# EAGLE design MapleIoT_P2_V1.0 (EAGLE 9.6.2)

## Sheet 1 of 2
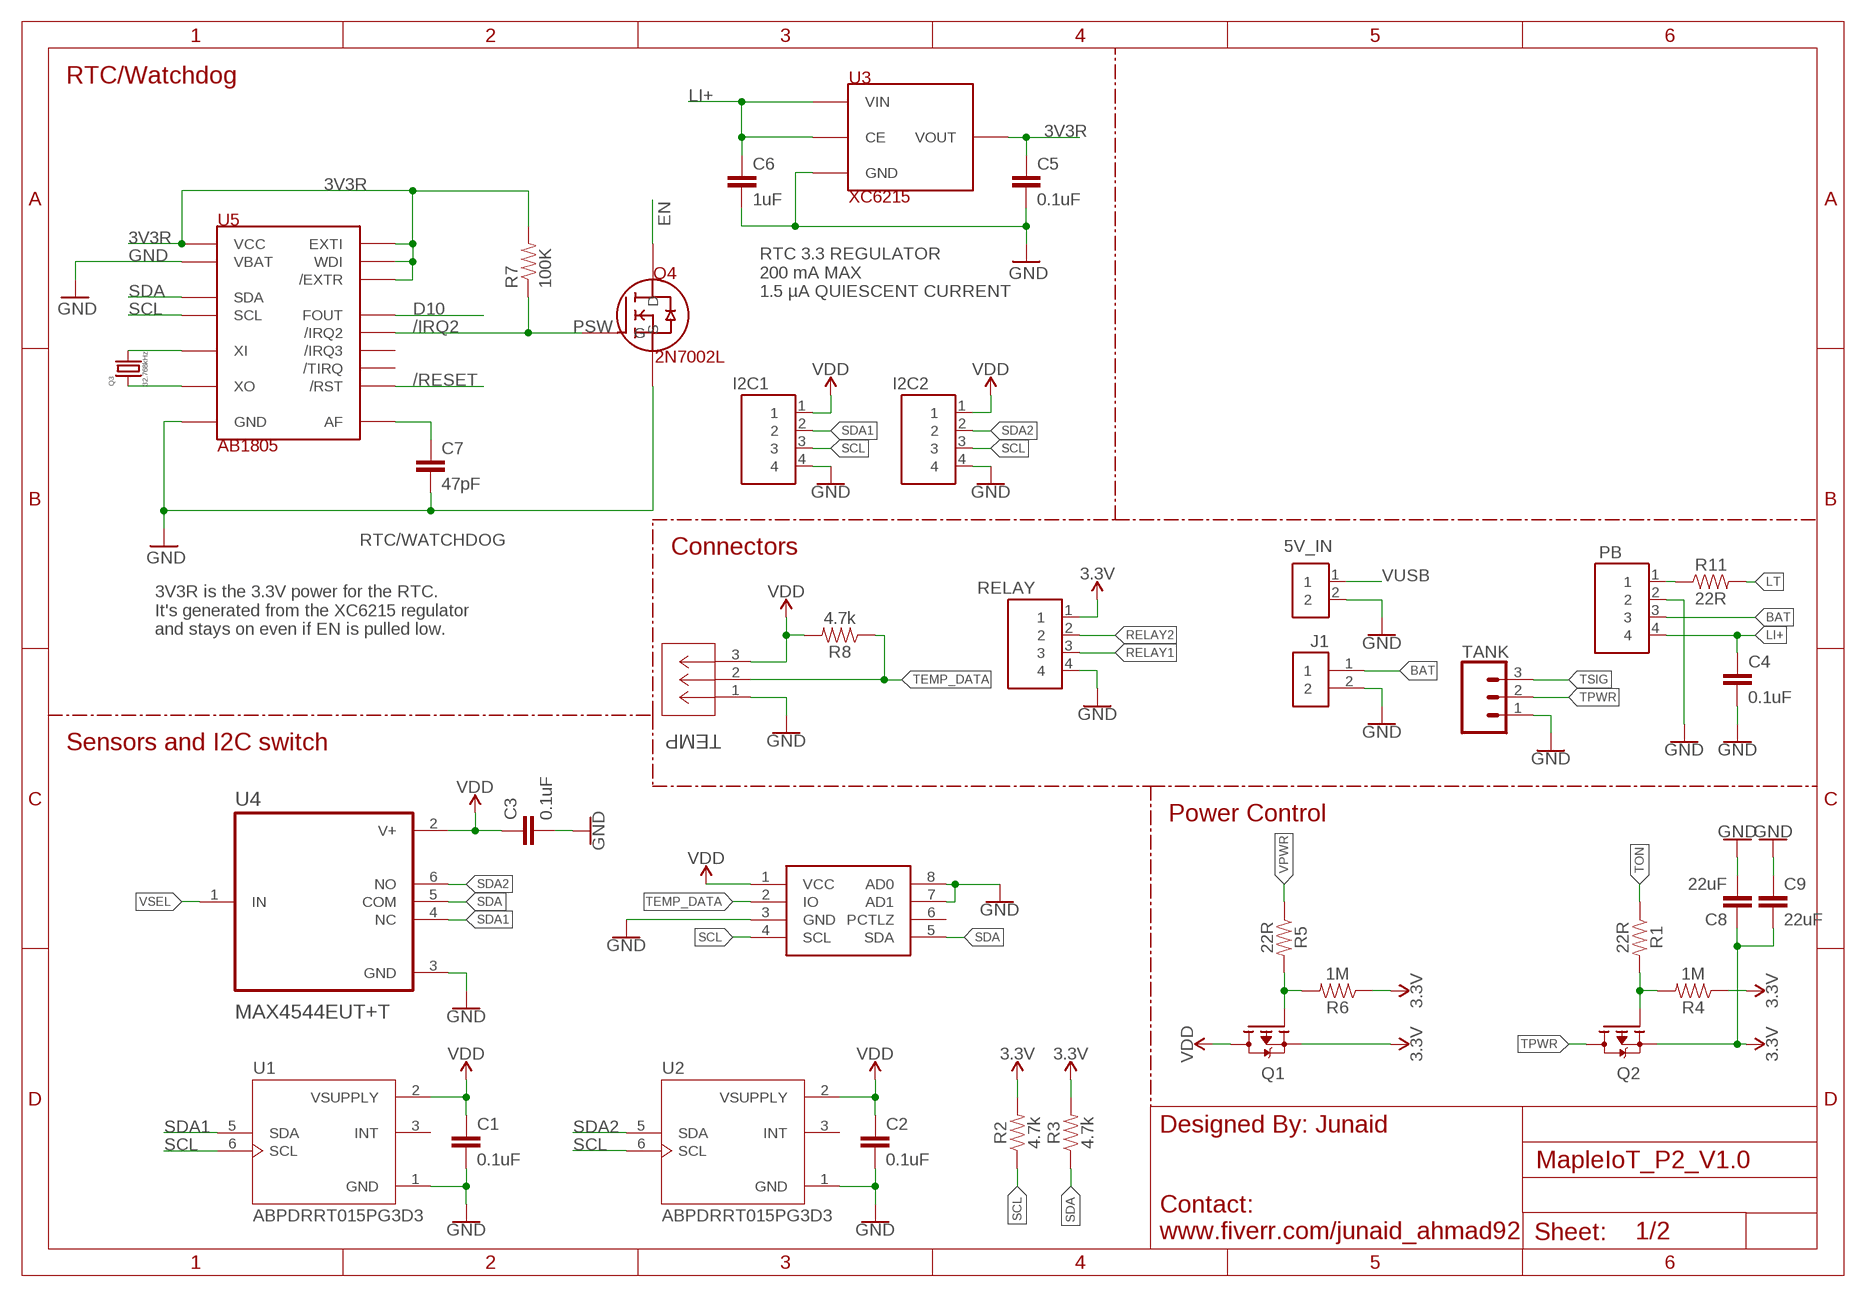
[diagram p0: schematic, sheet 1, part 1 of 2]
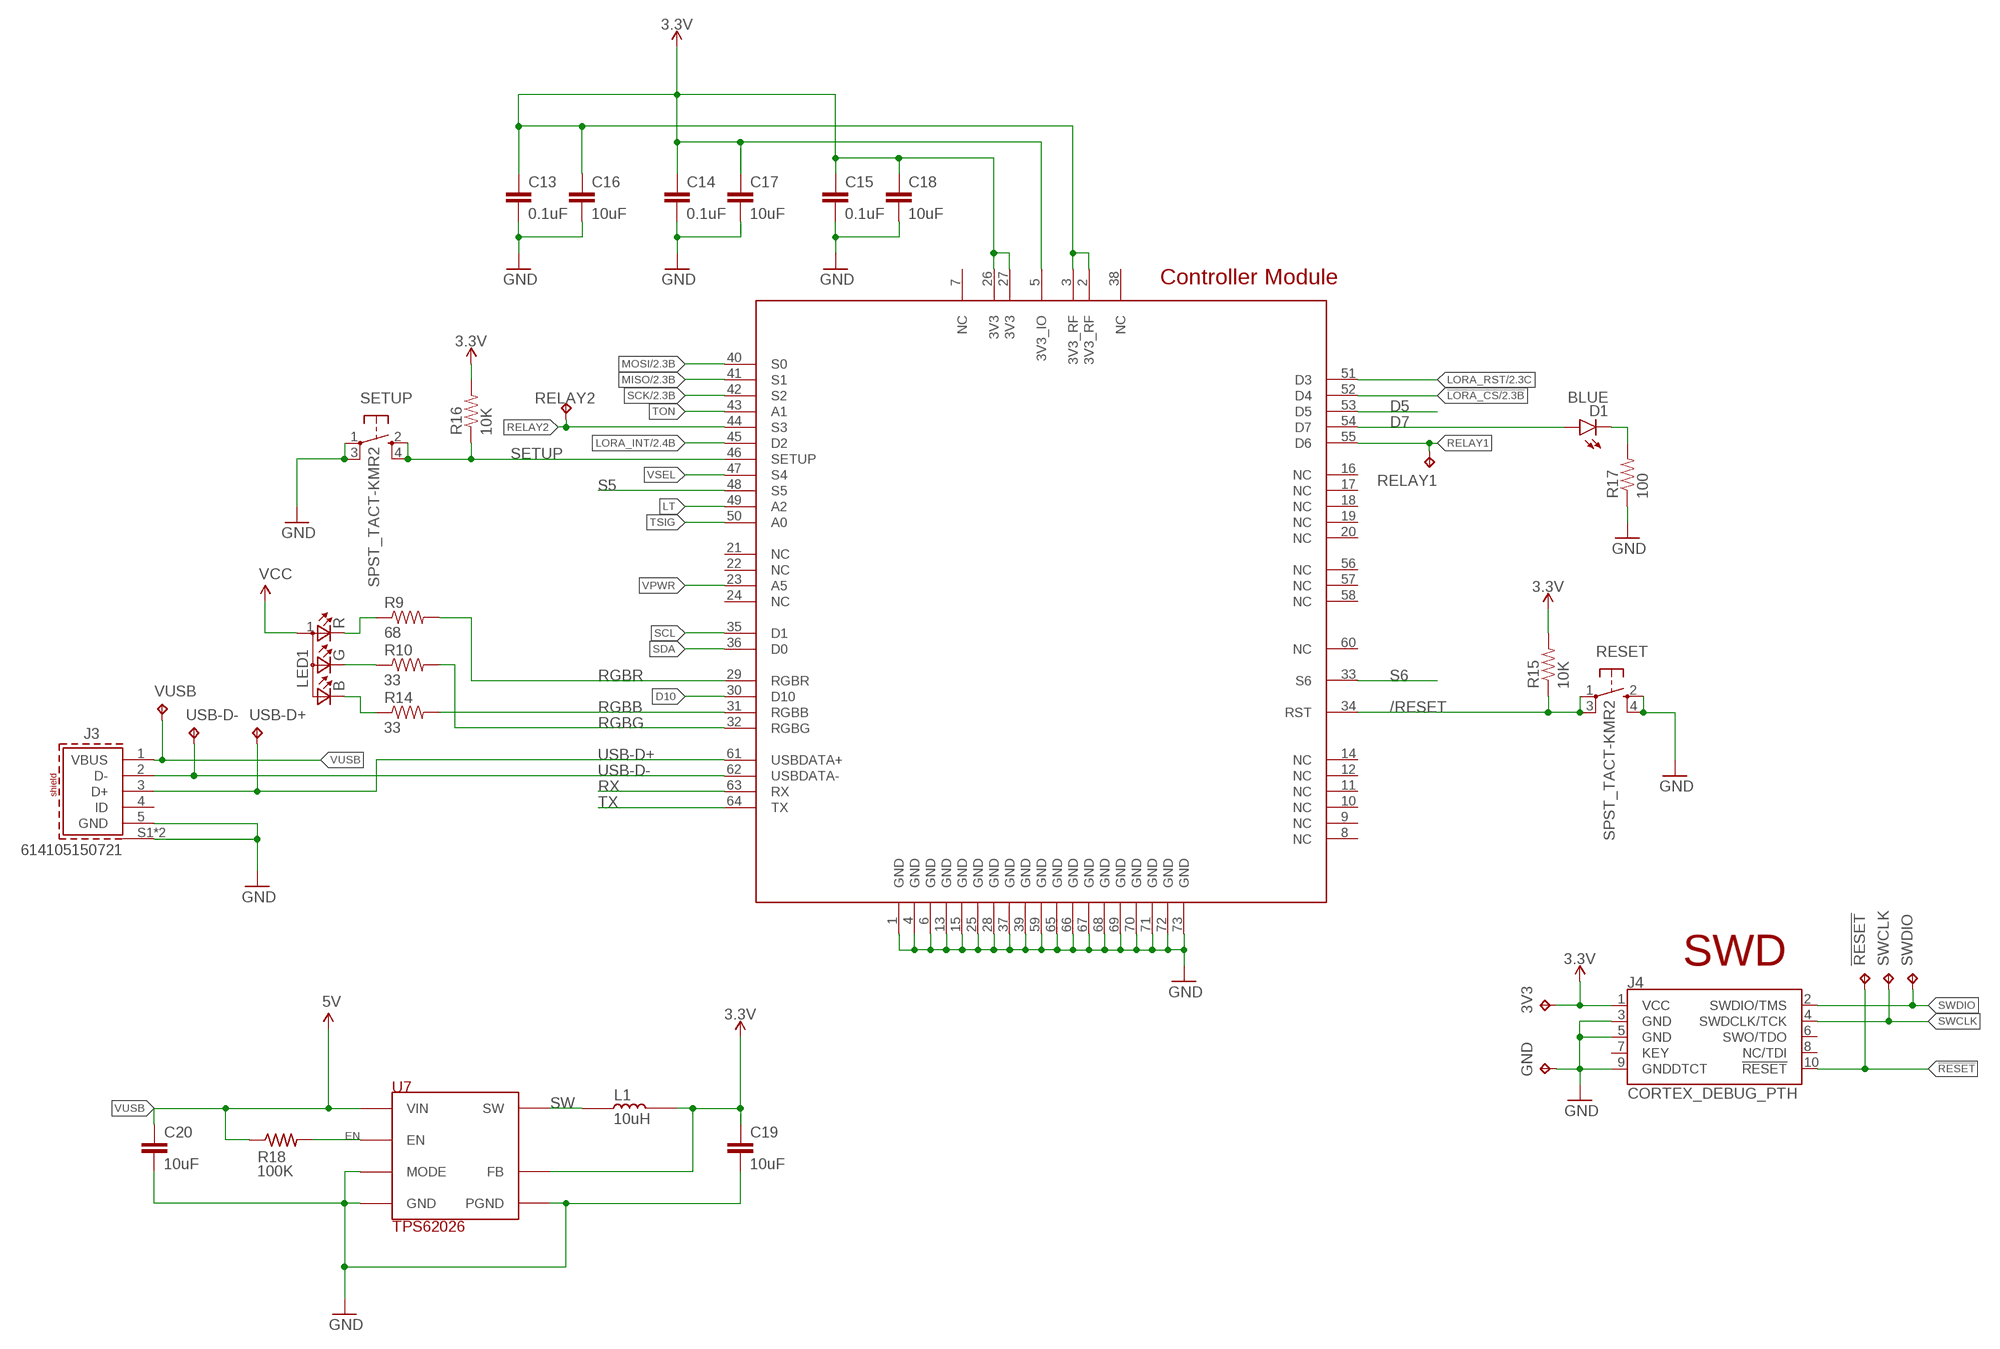
[diagram p1: schematic, sheet 1, part 2 of 2]

### Parts
3V3  TPTP15R  [TP15R]
5V_IN  B2B-XH-A(LF)(SN)  [SHDR2W64P0X250_1X2_740X575X700]
!RESET  TPTP15R  [TP15R]
C1  0.1uF  CAPACITORSC0603  [C0603]
C2  0.1uF  CAPACITORSC0603  [C0603]
C3  0.1uF  CAPACITORSC0603  [C0603]
C4  0.1uF  CAPACITORSC0603  [C0603]
C5  0.1uF  CAP-0.1UF-0603  [0603-CAP]
C6  1uF  CAP-1UF-0603.DEV  [0603-CAP]
C7  47pF  CAP-47PF-0603  [0603-CAP]
C8  22uF  CAPACITORSC1206  [C1206]
C9  22uF  CAPACITORSC1206  [C1206]
C13  0.1uF  CAP-0.1UF-0603  [0603-CAP]
C14  0.1uF  CAP-0.1UF-0603  [0603-CAP]
C15  0.1uF  CAP-0.1UF-0603  [0603-CAP]
C16  10uF  CAP-10UF-0603  [0603-CAP]
C17  10uF  CAP-10UF-0603  [0603-CAP]
C18  10uF  CAP-10UF-0603  [0603-CAP]
C19  10uF  CAP-10UF-0603  [0603-CAP]
C20  10uF  CAP-10UF-0603  [0603-CAP]
D1  BLUE  LED-BLUE0603  [LED-0603]
GND  TPTP15R  [TP15R]
I2C1  B4B-XH-A(LF)(SN)  [SHDR4W64P0X250_1X4_1240X575X70]
I2C2  B4B-XH-A(LF)(SN)  [SHDR4W64P0X250_1X4_1240X575X70]
J1  B2B-PH-K-S(LF)(SN)  [JST_B2B-PH-K-S(LF)(SN)]
J3  614105150721  [614105150721]
J4  CORTEX_DEBUG_PTH  [2X5-PTH-1.27MM]
L1  10uH  INDUCTOR-10UH  [BOURNS-INDUCTOR-3X3]
LED1  LED-RGB-CREE-SMD  [LED-RGB-CREE-SMD]
PB  B4B-XH-A(LF)(SN)  [SHDR4W64P0X250_1X4_1240X575X70]
Q1  PMV65XP,215  [SOT95P230X110-3N]
Q2  PMV65XP,215  [SOT95P230X110-3N]
Q3  32.768kHz  ABS07-120-32.768KHZ  [ABS07-120-CRYSTAL]
Q4  2N7002L  [2N7002L]
R1  22R  RESISTORSR0603  [R0603]
R2  4.7k  RESISTORSR0603  [R0603]
R3  4.7k  RESISTORSR0603  [R0603]
R4  1M  RESISTORSR0603  [R0603]
R5  22R  RESISTORSR0603  [R0603]
R6  1M  RESISTORSR0603  [R0603]
R7  100K  RES-100K-0603  [0603-RES]
R8  4.7k  RESISTORSR0603  [R0603]
R9  68  RES-68-0603.DEV  [0603-RES]
R10  33  RES-33-0603.DEV  [0603-RES]
R11  22R  RESISTORSR0603  [R0603]
R14  33  RES-33-0603.DEV  [0603-RES]
R15  10K  RES-10K-06030603  [0603-RES]
R16  10K  RES-10K-06030603  [0603-RES]
R17  100  RES-100-0603.DEV  [0603-RES]
R18  100K  RES_100K_0603  [R0603_P]
RELAY  B4B-XH-A(LF)(SN)  [SHDR4W64P0X250_1X4_1240X575X70]
RELAY1  TPTP15R  [TP15R]
RELAY2  TPTP15R  [TP15R]
RESET  SPST_TACT-KMR2  [KMR2]
SETUP  SPST_TACT-KMR2  [KMR2]
SWCLK  TPTP15R  [TP15R]
SWDIO  TPTP15R  [TP15R]
TANK  B3B-XH-A(LF)(SN)  [SHDR3W64P0X250_1X3]
TEMP  B3B-PH-K-S(LF)(SN)  [CONN_B3B-PH-K-S(LF)(SN)_JST]
U1  ABPDRRT015PG3D3  ABPDLNN100MG2A3  [XDCR_ABPDLNN100MG2A3]
U2  ABPDRRT015PG3D3  ABPDLNN100MG2A3  [XDCR_ABPDLNN100MG2A3]
U3  XC6215  [SOT-25-TOREX]
U4  MAX4544EUT+T  [SOT95P280X145-6N]
U5  AB1805  [16-VFQFN-ABRACON]
U7  TPS62026  TPS62026-REG-3.3V  [10-HVSSOP-TI]
U$2  DS2482-100  [8-SOIC-MAXIM]
U$3  P2  [P2]
USB-D+  TPTP15R  [TP15R]
USB-D-  TPTP15R  [TP15R]
VUSB  TPTP15R  [TP15R]

### Nets
3.3V: 3V3.TP C8.1 C9.2 C13.1 C14.1 C15.1 C16.1 C17.1 C18.1 C19.1 J4.1(VCC) L1.2 Q1.2(S) Q2.2(S) R2.2 R3.2 R4.1 R6.1 R15.2 R16.2 RELAY.1 U7.5(FB) U$3.2(3V3_RF) U$3.3(3V3_RF) U$3.5(3V3_IO) U$3.26(3V3) U$3.27(3V3) ; also sheet 2
3V3: LED1.1(A) ; supply symbol labelled VCC
3V3R: C5.1 R7.2 U3.5(VOUT) U5.2(WDI) U5.3(/EXTR) U5.10(EXTI) U5.13(VCC)
!LORA_CS: U$3.52(D4) ; also sheet 2
!RESET: !RESET.TP J4.10(!RESET)
/IRQ2: Q4.1(G) R7.1 U5.4(/IRQ2)
/RESET: R15.1 RESET.1(P) RESET.3(P1) U5.1(/RST) U$3.34(RST)
AF: C7.1 U5.14(AF)
BAT: J1.1 PB.3
D5: U$3.53(D5)
D7: D1.A U$3.54(D7)
D10: U5.11(FOUT) U$3.30(D10)
EN: Q4.3(D) R18.2 U7.1(EN)
GND: 5V_IN.2 C1.2 C2.2 C3.2 C4.2 C5.2 C6.2 C7.2 C8.2 C9.1 C13.2 C14.2 C15.2 C16.2 C17.2 C18.2 C19.2 C20.2 GND.TP I2C1.4 I2C2.4 J1.2 J3.5(GND) J3.S1(SHIELD) J3.S2(SHIELD) J4.3(GND) J4.5(GND) J4.9(GNDDTCT) PB.2 Q4.2(S) R17.1 RELAY.4 RESET.2(S) RESET.4(S1) SETUP.1(P) SETUP.3(P1) TANK.1 TEMP.1 U1.1(GND) U2.1(GND) U3.2(GND) U4.3(GND) U5.5(VBAT) U5.9(GND) U5.EP(GND) U7.4(GND) U7.6(MODE) U7.9(PGND) U7.10(PGND) U7.P(GND) U$2.3(GND) U$2.7(AD1) U$2.8(AD0) U$3.1(GND) U$3.4(GND) U$3.6(GND) U$3.13(GND) U$3.15(GND) U$3.25(GND) U$3.28(GND) U$3.37(GND) U$3.39(GND) U$3.59(GND) U$3.65(GND) U$3.66(GND) U$3.67(GND) U$3.68(GND) U$3.69(GND) U$3.70(GND) U$3.71(GND) U$3.72(GND) U$3.73(GND) ; also sheet 2
LI+: C4.1 C6.1 PB.4 U3.1(VIN) U3.3(CE)
LORA_INT: U$3.45(D2) ; also sheet 2
LORA_RST: U$3.51(D3) ; also sheet 2
LT: R11.2 U$3.49(A2)
MISO: U$3.41(S1) ; also sheet 2
MOSI: U$3.40(S0) ; also sheet 2
N$1: Q2.1(G) R1.2 R4.2
N$2: Q1.1(G) R5.2 R6.2
N$3: PB.1 R11.1
N$5: D1.C R17.2
N$6: LED1.4(R) R9.1
N$7: LED1.3(G) R10.1
N$8: LED1.2(B) R14.1
RELAY1: RELAY1.TP RELAY.3 U$3.55(D6)
RELAY2: RELAY2.TP RELAY.2 U$3.44(S3)
RGBB: R14.2 U$3.31(RGBB)
RGBG: R10.2 U$3.32(RGBG)
RGBR: R9.2 U$3.29(RGBR)
RX: U$3.63(RX)
S5: U$3.48(S5)
S6: U$3.33(S6)
SCK: U$3.42(S2) ; also sheet 2
SCL: I2C1.3 I2C2.3 R2.1 U1.6(SCL) U2.6(SCL) U5.7(SCL) U$2.4(SCL) U$3.35(D1)
SDA: R3.1 U4.5(COM) U5.6(SDA) U$2.5(SDA) U$3.36(D0)
SDA1: I2C1.2 U1.5(SDA) U4.4(NC)
SDA2: I2C2.2 U2.5(SDA) U4.6(NO)
SETUP: R16.1 SETUP.2(S) SETUP.4(S1) U$3.46(SETUP)
SW: L1.1 U7.7(SW) U7.8(SW)
SWCLK: J4.4(SWDCLK/TCK) SWCLK.TP
SWDIO: J4.2(SWDIO/TMS) SWDIO.TP
TEMP_DATA: R8.1 TEMP.2 U$2.2(IO)
TON: R1.1 U$3.43(A1)
TPWR: Q2.3(D) TANK.2
TSIG: TANK.3 U$3.50(A0)
TX: U$3.64(TX)
USB-D+: J3.3(D+) U$3.61(USBDATA+) USB-D+.TP
USB-D-: J3.2(D-) U$3.62(USBDATA-) USB-D-.TP
VDD: C1.1 C2.1 C3.1 I2C1.1 I2C2.1 Q1.3(D) R8.2 TEMP.3 U1.2(VSUPPLY) U2.2(VSUPPLY) U4.2(V+) U$2.1(VCC)
VPWR: R5.1 U$3.23(A5)
VSEL: U4.1(IN) U$3.47(S4)
VUSB: 5V_IN.1 C20.1 J3.1(VBUS) R18.1 U7.2(VIN) U7.3(VIN) VUSB.TP ; supply symbol labelled 5V
XI: Q3.2 U5.16(XI)
XO: Q3.1 U5.15(XO)
Unconnected: J3.4(ID) J4.6(SWO/TDO) J4.7(KEY) J4.8(NC/TDI) U1.3(INT) U2.3(INT) U5.8(/IRQ3) U5.12(/TIRQ) U$2.6(PCTLZ) U$3.7(NC) U$3.8(NC) U$3.9(NC) U$3.10(NC) U$3.11(NC) U$3.12(NC) U$3.14(NC) U$3.16(NC) U$3.17(NC) U$3.18(NC) U$3.19(NC) U$3.20(NC) U$3.21(NC) U$3.22(NC) U$3.24(NC) U$3.38(NC) U$3.56(NC) U$3.57(NC) U$3.58(NC) U$3.60(NC)

### Notes on the sheet
- RTC/Watchdog
- Controller Module
- RTC 3.3 REGULATOR
  200 mA MAX
  1.5 µA QUIESCENT CURRENT
- PSW
- RTC/WATCHDOG
- Connectors
- 3V3R is the 3.3V power for the RTC.
  It's generated from the XC6215 regulator
  and stays on even if EN is pulled low.
- Sensors and I2C switch
- Power Control
- SWD

## Sheet 2 of 2
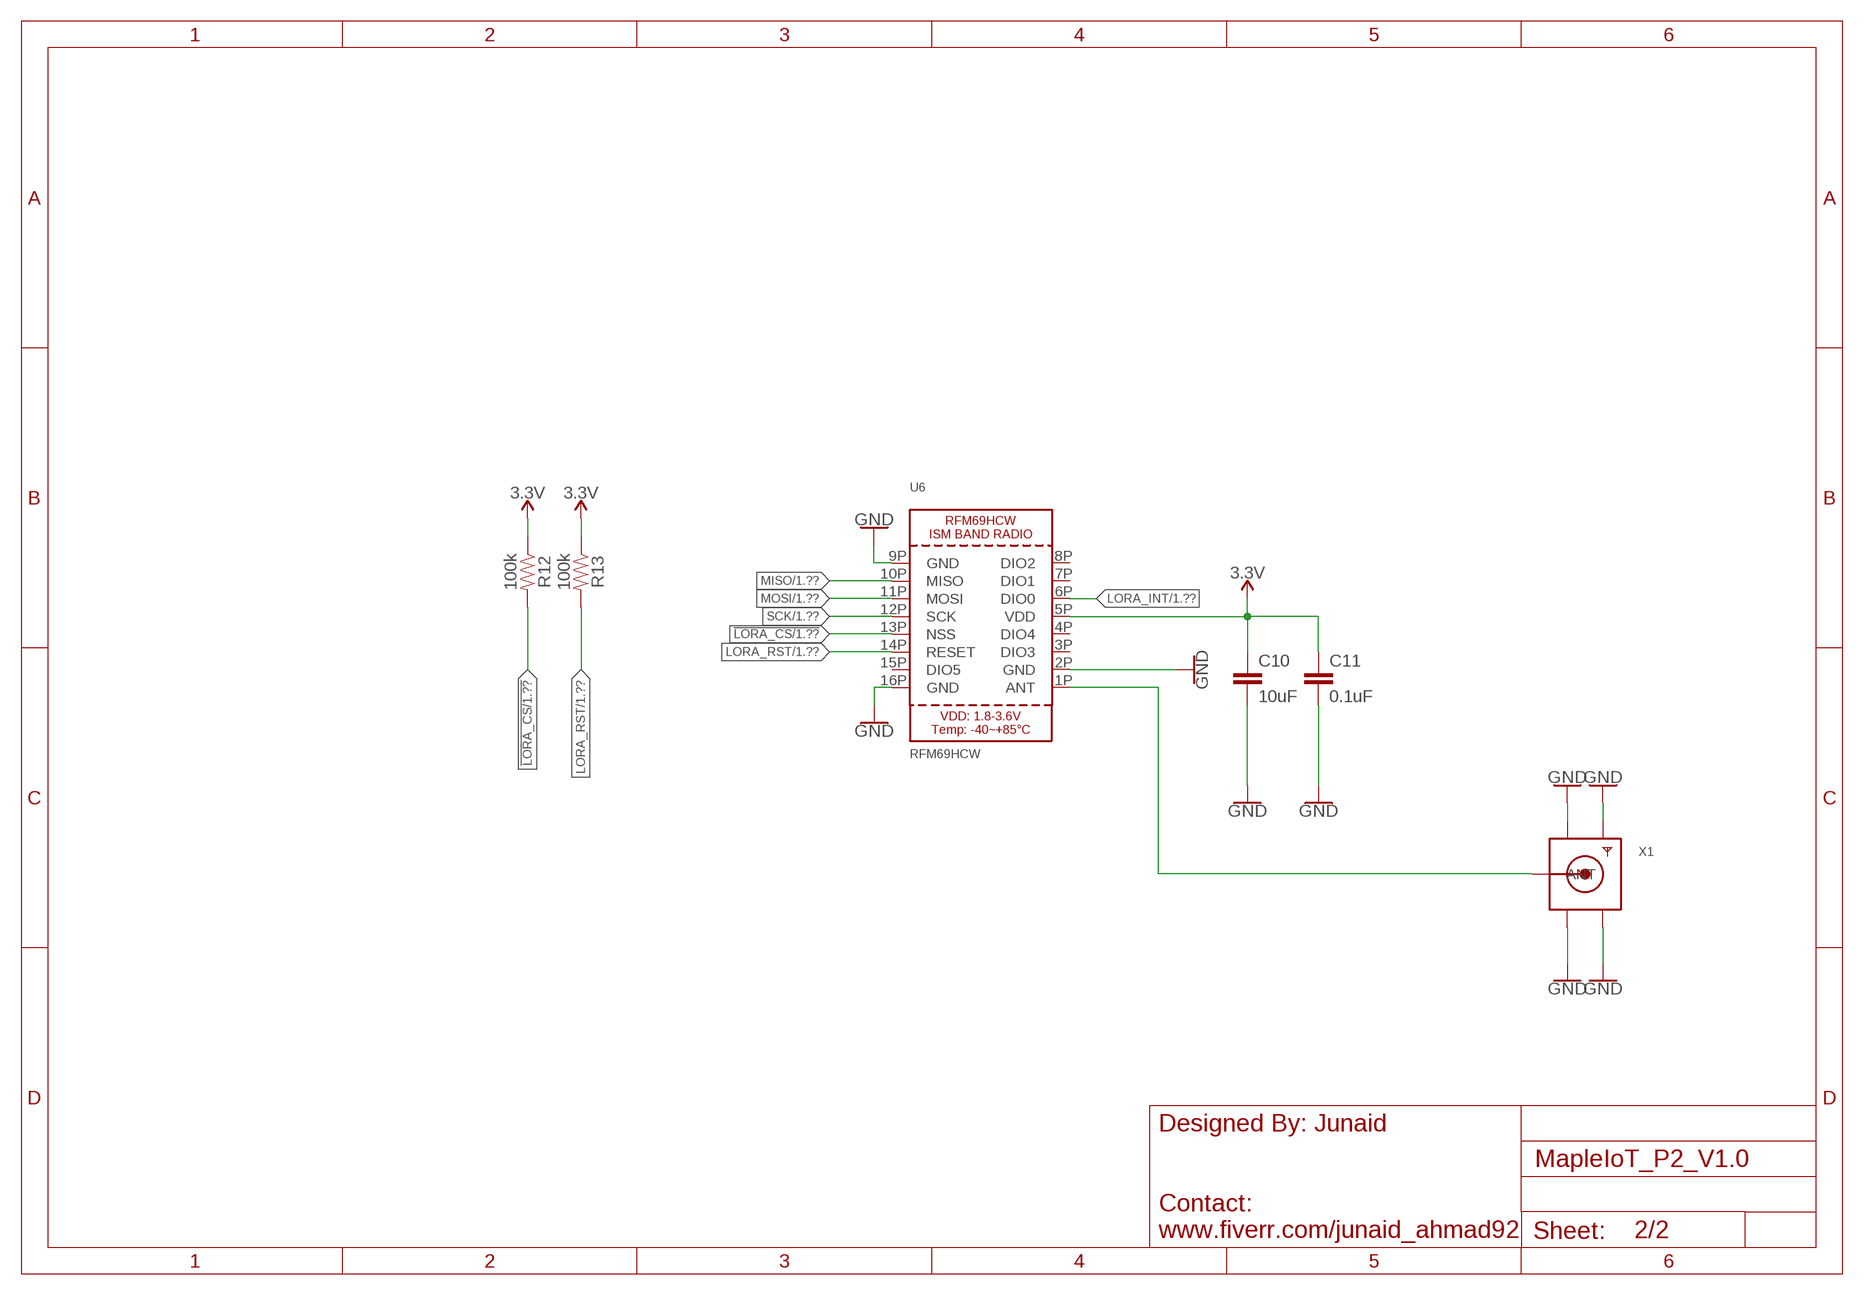
[diagram p2: schematic, sheet 2]

### Parts
C10  10uF  CAPACITORSC0603  [C0603]
C11  0.1uF  CAPACITORSC0603  [C0603]
R12  100k  RESISTORSR0603  [R0603]
R13  100k  RESISTORSR0603  [R0603]
U6  RFM69HCW  RFM69HCW_SMT  [RFMHCW_SMT]
X1  SMACONNECTOR  [SMA90_DIP]

### Nets
3.3V: C10.1 C11.1 R12.1 R13.1 U6.5P(VDD) ; also sheet 1
!LORA_CS: R12.2 U6.13P(NSS) ; also sheet 1
GND: C10.2 C11.2 U6.2P(GND) U6.9P(GND) U6.16P(GND) X1.GND1 X1.GND2 X1.GND3 X1.GND4 ; also sheet 1
LORA_INT: U6.6P(DIO0) ; also sheet 1
LORA_RST: R13.2 U6.14P(RESET) ; also sheet 1
MISO: U6.10P(MISO) ; also sheet 1
MOSI: U6.11P(MOSI) ; also sheet 1
N$4: U6.1P(ANT) X1.ANTENNA(ANT)
SCK: U6.12P(SCK) ; also sheet 1
Unconnected: U6.3P(DIO3) U6.4P(DIO4) U6.7P(DIO1) U6.8P(DIO2) U6.15P(DIO5)

## Library data of the parts
3V3 !RESET GND RELAY1 RELAY2 SWCLK SWDIO USB-D+ USB-D- VUSB = BeagleBone_Blue_R3:TP: Test pad
5V_IN = My-custom-components:B2B-XH-A(LF)(SN): JST XH Series, 2.5mm Pitch 2 Way 1 Row Straight PCB Header, Solder Termination, 3A Source: Datasheet <http://docs-emea.rs-online.com/webdocs/1357/0900766b81357f2f.pdf>; ARROW_PART_NUMBER: B2B-XH-A(LF)(SN); ARROW_PRICE-STOCK: https://www.arrow.com/en/products/b2b-xh-a-lf-sn/jst-manufacturing; DESCRIPTION: JST XH Series, 2.5mm Pitch 2 Way 1 Row Straight PCB Header, Solder Termination, 3A; HEIGHT: 7mm; MANUFACTURER_NAME: JST (JAPAN SOLDERLESS TERMINALS); MANUFACTURER_PART_NUMBER: B2B-XH-A(LF)(SN); RS_PART_NUMBER: 1667312; RS_PRICE-STOCK: http://uk.rs-online.com/web/p/products/1667312
C1-C4 C8-C11 = My-custom-components:CAPACITORS
C5 C13-C15 = rickk2:CAP-0.1UF-0603: CAP CER 0.1UF 16V X7R 0603 https://www.digikey.com/product-detail/en/murata-electronics-north-america/GRM188R71C104KA01D/490-1532-1-ND/587771
C6 = rickk2:CAP-1UF-0603.DEV: CAP CER 1UF 25V X7R 0603 $ 0.10 Samsung CL10B105KA8NNNC https://www.digikey.com/product-detail/en/samsung-electro-mechanics-america-inc/CL10B105KA8NNNC/1276-1184-1-ND/3889270 1µF ±10% 25V Ceramic Capacitor X7R 0603 (1608 Metric)
C7 = rickk2:CAP-47PF-0603: CAP CER 47PF 100V C0G/NP0 0603 Murata Electronics GCM1885C2A470FA16D $0.22 47pF ±1% 100V Ceramic Capacitor C0G, NP0 0603 (1608 Metric) https://www.digikey.com/product-detail/en/murata-electronics/GCM1885C2A470FA16D/490-16408-1-ND/7363390 - Not ordered yet!
C16-C20 = rickk2:CAP-10UF-0603: CAP CER 10UF 16V X5R 0805 $ 0.21 https://www.digikey.com/product-detail/en/murata-electronics-north-america/GRM21BR61C106KE15L/490-3886-1-ND/965928
D1 = rickk2:LED-BLUE: Lite-On LTST-C193TBKT-5A 0603 clear lens 6.25 mcd 130° viewing 15 mcd 5mA @ 2.8V $0.47 Blue 470nm LED Indication - Discrete 2.8V 0603 (1608 Metric) https://www.digikey.com/product-detail/en/lite-on-inc/LTST-C193TBKT-5A/160-1827-1-ND/2355044 R = 100 ohms @ 3.3V Stripe is on the anode (+) side on the bottom side!
I2C1 I2C2 PB RELAY = My-custom-components:B4B-XH-A(LF)(SN): XH-2.5mm Header top entry 4 way JST XH Series, Series Number B4B, 2.5mm Pitch 4 Way 1 Row Straight PCB Header, Solder Termination, 3A Source: Datasheet <http://uk.rs-online.com/web/p/products/8201551>; DESCRIPTION: XH-2.5mm Header top entry 4 way JST XH Series, Series Number B4B, 2.5mm Pitch 4 Way 1 Row Straight PCB Header, Solder Termination, 3A; HEIGHT: 7mm; MANUFACTURER_NAME: JST (JAPAN SOLDERLESS TERMINALS); MANUFACTURER_PART_NUMBER: B4B-XH-A(LF)(SN); RS_PART_NUMBER: 8201551P; RS_PRICE-STOCK: http://uk.rs-online.com/web/p/products/8201551P
J1 = B2B-PH-K-S_LF__SN_:B2B-PH-K-S(LF)(SN): PH Series 2 Position 2 mm Pitch Through Hole Top Entry Shrouded Header; DESCRIPTION: Connector Header Through Hole 2 position 0.079 (2.00mm); DIGI-KEY_PART_NUMBER: 455-1704-ND; MF: JST Sales; MP: B2B-PH-K-S(LF)(SN); PACKAGE: None
J3 = USB_614105150721:614105150721: WR-COM Micro USB 2.0 Type B Vertical 5 Contacts Kind Properties Durability:10 000 Mating cycles Quality Class:10 000 Mating cycles Connector Type:Micro USB Gender:Receptacle Type:Vertical General Information Operating Temperature:-40up to +105 °C Compliance:RoHS Electrical Properties IR 1:1.8A Working Voltage:30V (AC) Withstanding Voltage:100V (AC) Contact Resistance:30 mΩ Material Properties Insulator Material:LCP Insulator Flammability Rating:UL94 V-0 Color:Black Contact Material:Copper Alloy Contact Plating: Gold Contact Type:Stamped Shielding Material:Stainless Steel Shielding Plating:Matte Tin <https://www.we-online.com/catalog/media/o72645v209%20Family_WR-COM_Micro-USB-Type-B_Vertical_614105150721.jpg> Details see: https://www.we-online.com/catalog/en/COM_MICRO_TYPE_B_VERTICAL/ Updated by Yingchun, Shan 2020-01-16 2020 (C) Würth Elektronik; APPLICATION: Micro USB 2.0; DATASHEET-URL: https://www.we-online.com/catalog/datasheet/614105150721.pdf; GERDER: Receptacle; INTERFACE-TYPE: Type B; IR1: 1.8A; MOUNT: THT; PACKAGING: Tape and Reel; PART-NUMBER: 614105150721; PINS: 5; TYPE: Vertical; WORKING-VOLTAGE: 30V(AC)
J4 = SparkFun-Connectors:CORTEX_DEBUG: Cortex Debug Connector - 10 pin Supports JTAG debug, Serial Wire debug, and Serial Wire Viewer. PTH and SMD connector options available. General Connector Information <http://infocenter.arm.com/help/topic/com.arm.doc.faqs/attached/13634/cortex_debug_connectors.pdf> Products: PTH Connector <http://www.digikey.com/product-detail/en/cnc-tech/3220-10-0100-00/1175-1627-ND/3883661> -via Digi-Key SparkFun PSoc <https://www.sparkfun.com/products/13229> SparkFun T <https://www.sparkfun.com/products/13810>
L1 = rickk2:INDUCTOR-10UH: Bourns Inc. SRN3015-100M $0.46 FIXED IND 10UH 1A 276 MOHM SMD 10µH Semi-Shielded Wirewound Inductor 1A 276 mOhm Max Nonstandard https://www.digikey.com/product-detail/en/bourns-inc/SRN3015-100M/SRN3015-100MCT-ND/2756149
LED1 = rickk2:LED-RGB-CREE-SMD: LED RGB DIFFUSED 4SMD $ 0.35 Cree CLMVB-FKA-CFHEHLCBB7A363 2mm 4-PLCC common anode RGB LED https://www.digikey.com/product-detail/en/cree-inc/CLMVB-FKA-CFHEHLCBB7A363/CLMVB-FKA-CFHEHLCBB7A363CT-ND/6138627 Red=68 ohm, Green/Blue=33 ohm @ 3.3V
Q1 Q2 = My-custom-components:PMV65XP,215: Single P-Channel 20 V 833 mW 7.7 nC Silicon Surface Mount Mosfet - SOT-23; DESCRIPTION: PMV Series 20 V 76 mO 1.92 W P-Channel TrenchMOS Low Level FET -SOT-23-3; DIGI-KEY_PART_NUMBER: 1727-3124-1-ND; DIGI-KEY_PURCHASE_URL: https://www.digikey.pk/product-detail/en/nexperia-usa-inc/PMV65XP,215/1727-3124-1-ND/949693?utm_source=snapeda&utm_medium=aggregator&utm_campaign=symbol; MF: Nexperia USA; MP: PMV65XP,215; PACKAGE: SC-59 NXP Semiconductors
Q3 = rickk2:ABS07-120-32.768KHZ: CRYSTAL 32.7680KHZ 6PF SMD Abracon LLC ABS07-120-32.768KHZ-T $0.77 32.768kHz ±20ppm Crystal 6pF 55 kOhms 2-SMD, No Lead https://www.digikey.com/product-detail/en/abracon-llc/ABS07-120-32-768KHZ-T/535-11937-1-ND/3724046 - Not ordered yet
Q4 = rickk2:2N7002L: MOSFET N-CH 60V 0.115A SOT-23 $ 0.16 On Semicondutor 2N7002LT1G N-Channel 115mA (Tc) 225mW (Ta) Surface Mount SOT-23-3 (TO-236) https://www.digikey.com/product-detail/en/on-semiconductor/2N7002LT3G/2N7002LT3GOSCT-ND/2704932 1=G, high=D is connected to S (GND), the "on" state 2=S to GND (bottom of symbol) 3=D to load (top of symbol, pin on the side by itself) 2A version: Diodes Inc DMN6075S-7 MOSFET N-CH 60V 2A SOT23-3 $0.45 https://www.digikey.com/product-detail/en/diodes-incorporated/DMN6075S-7/DMN6075S-7DICT-ND/5149299 Old: https://www.digikey.com/product-detail/en/on-semiconductor/2N7002LT1G/2N7002LT1GOSCT-ND/917791
R1-R6 R8 R11-R13 = My-custom-components:RESISTORS
R7 = rickk2:RES-100K-0603: 100 kOhms ±1% 0.1W, 1/10W Chip Resistor 0603 (1608 Metric) Automotive AEC-Q200 Thick Film https://www.digikey.com/product-detail/en/panasonic-electronic-components/ERJ-3EKF1003V/P100KHCT-ND/198110 Old: RES SMD 100K OHM 1% 1/4W 0603 $ 0.16 Panasonic ERJ-PA3F1003V ±1% 0.25W, 1/4W Chip Resistor 0603 (1608 Metric) Automotive AEC-Q200, Pulse Withstanding Thick Film https://www.digikey.com/product-detail/en/panasonic-electronic-components/ERJ-PA3F1003V/P100KBYCT-ND/5036116
R9 = rickk2:RES-68-0603.DEV: https://www.digikey.com/product-detail/en/panasonic-electronic-components/ERJ-3EKF68R0V/P68.0HCT-ND/1746805 Panasonic SMD 0603 1% 1/10W
R10 R14 = rickk2:RES-33-0603.DEV: https://www.digikey.com/product-detail/en/panasonic-electronic-components/ERJ-3EKF33R0V/P33.0HCT-ND/1746765 Panasonic SMD 0603 1% 1/10W
R15 R16 = rickk2:RES-10K-0603: RES SMD 10K OHM 5% 1/4W 0603 $ 0.10 https://www.digikey.com/product-detail/en/panasonic-electronic-components/ERJ-PA3J103V/P10KBZCT-ND/5036237
R17 = rickk2:RES-100-0603.DEV: RES SMD 100 OHM 5% 1/10W 0603 $ 0.10 ±5% 0.1W, 1/10W Chip Resistor 0603 (1608 Metric) Automotive AEC-Q200 Thick Film https://www.digikey.com/product-detail/en/panasonic-electronic-components/ERJ-3GEYJ101V/P100GCT-ND/134714
R18 = particle-studios:RES_: Particle Resistors; DESP: RES SMD 100K OHM 1% 1/10W 0603
RESET SETUP = adafruit:SPST_TACT: SMT 6mm switch, EVQQ2 series http://www.ladyada.net/library/eagle
TANK = My-custom-components:B3B-XH-A(LF)(SN)
TEMP = B3B-PH:B3B-PH-K-S(LF)(SN); BUILT_BY: EMA_Cory; COPYRIGHT: Copyright (C) 2018 Accelerated Designs. All rights reserved; MANUFACTURER_PART_NUMBER: B3B-PH-K-S(LF)(SN); SOURCELIBRARY: JST_2019-12-02; VENDOR: JST
U1 U2 = ABPDLNN100MG2A3:ABPDLNN100MG2A3: Pressure Sensor, Amplified, 100 mbar, Gauge, Single Axial Barbless, Digital, 3.3 VDC, 3.1 mA; AVAILABILITY: Unavailable; DESCRIPTION: Pressure Sensor 1.45PSI (10kPa) Vented Gauge Male - 0.11 (2.67mm) Tube 12 b 6-DIP Module; MF: Honeywell Sensing; MP: ABPDRRT015PG3D3; PACKAGE: DIP-6 Honeywell; PRICE: None
U3 = rickk2:XC6215: IC REG LINEAR 3.3V 200MA SOT25 Torex Semiconductor Ltd XC6215B332MR-G $0.71 Linear Voltage Regulator IC 1 Output 200mA SOT-25 https://www.digikey.com/product-detail/en/torex-semiconductor-ltd/XC6215B332MR-G/893-1078-1-ND/2138269 - Not ordered yet - 6V max input - 3.3V output 200 mA - 1.5µA quiescent current - 1uF input cap, 0.1 uF output cap - CE high to enable
U4 = MAX4544EUT_T:MAX4544EUT+T; DESCRIPTION: 1 Circuit IC Switch 2:1 60Ohm SOT-23-6; DIGI-KEY_PART_NUMBER: MAX4544EUT+TCT-ND; MF: Maxim Integrated; MP: MAX4544EUT+T; PACKAGE: SOT-23-6 Maxim
U5 = rickk2:AB1805: Abracon LLC AB1805-T3 $1.79 IC RTC CLK/CALENDAR I2C 16-QFN Real Time Clock (RTC) IC Clock/Calendar 256B I²C, 2-Wire Serial 16-VFQFN Exposed Pad https://www.digikey.com/product-detail/en/abracon-llc/AB1805-T3/535-11932-1-ND/3661512
U6 = microbuilder:RFM69HCW: RFM69HCW - ISM Band RF Transceiver
U7 = rickk2:TPS62026-REG-3.3V: Texas Instruments TPS62026DGQR $2.36 IC REG BUCK 3.3V 600MA 10MSOP Buck Switching Regulator IC Positive Fixed 3.3V 1 Output 600mA 10-PowerTFSOP, 10-MSOP (0.118", 3.00mm Width) https://www.digikey.com/en/products/detail/texas-instruments/TPS62026DGQ/1672251 3.6V to 6V input 10uH inductor, 10 uF input and output caps
U$2 = rickk2:DS2482-100: IC BRIDGE I2C TO 1-WIRE 8-SOIC $1.54 1-Wire® Bridge, 1-Wire® to I²C I²C Interface 8-SOIC https://www.digikey.com/product-detail/en/maxim-integrated/DS2482S-100-/DS2482S-100--ND/1197435
U$3 = rickk2:P2: Particle P2 module (WiFi with antenna)
X1 = adafruit:SMACONNECTOR: SMA Connector 90° DIP SMA Connector, 50 Ohm (4UConnector: 07259)

## Net classes
1 diff pair: width 0.483 mm, drill 0.3 mm, clearance 0.152 mm

## Board
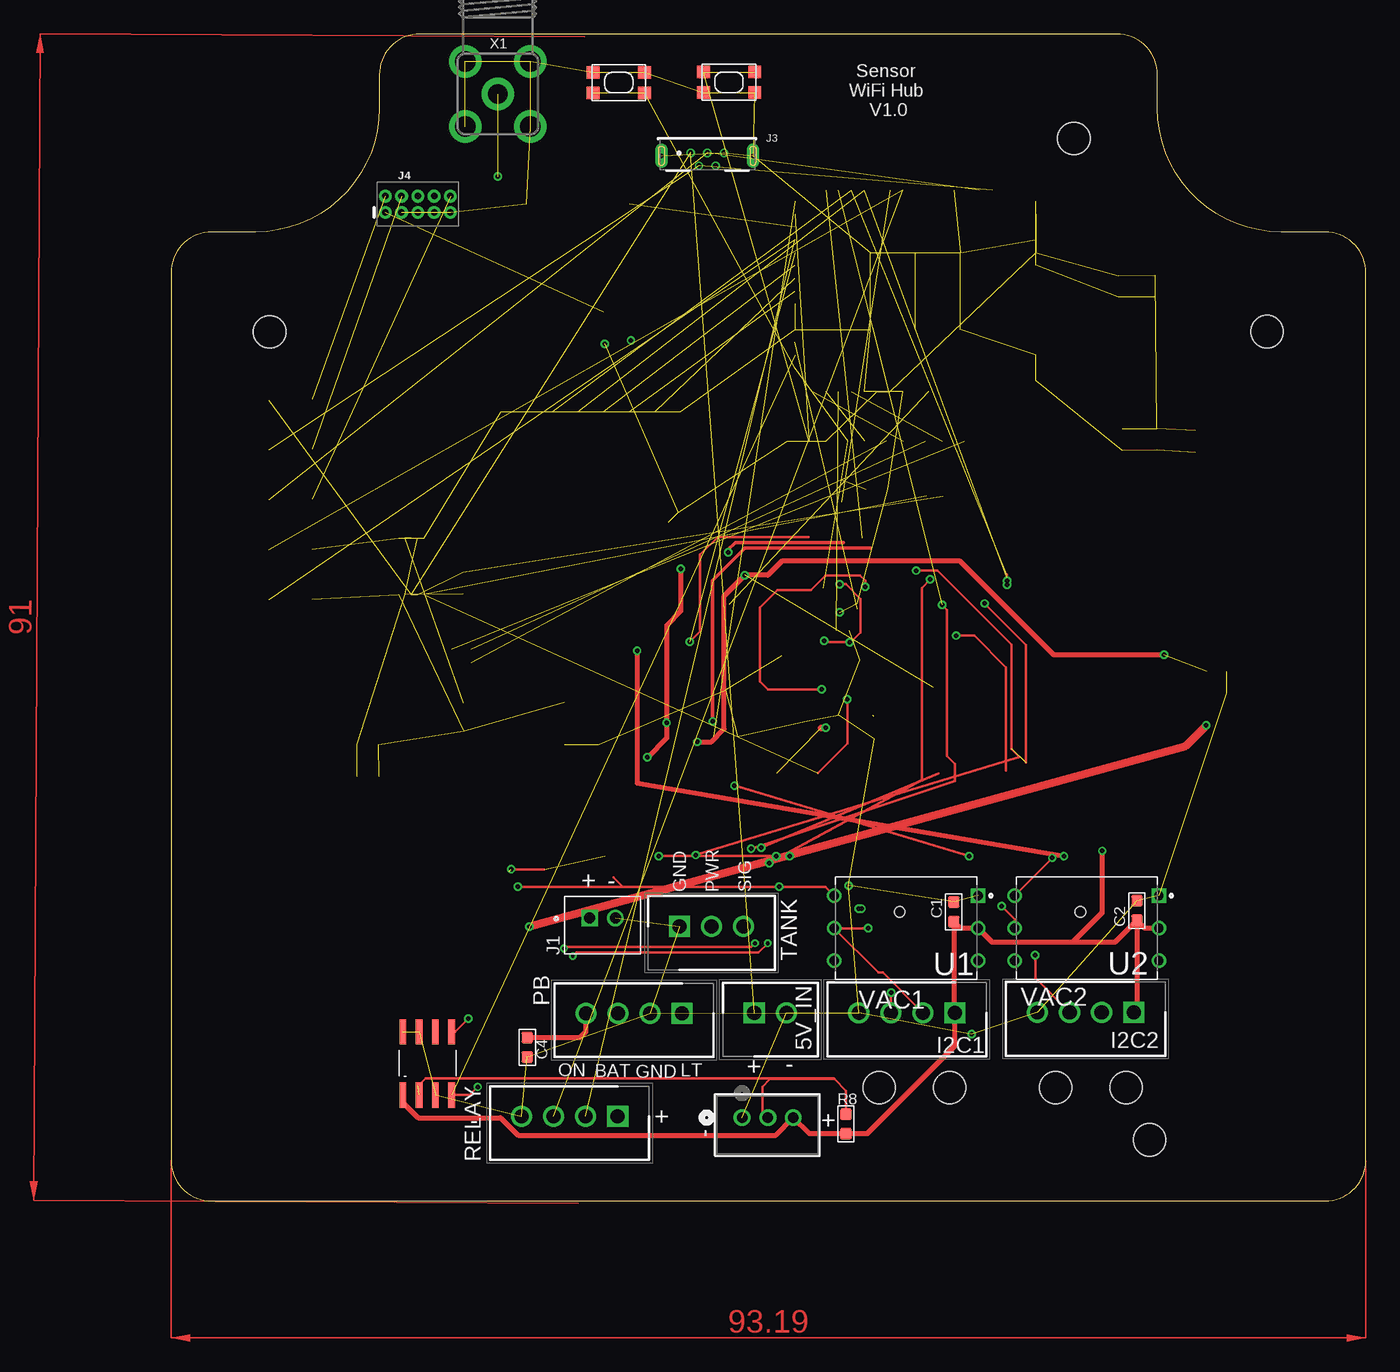
[diagram p3: board, top side]
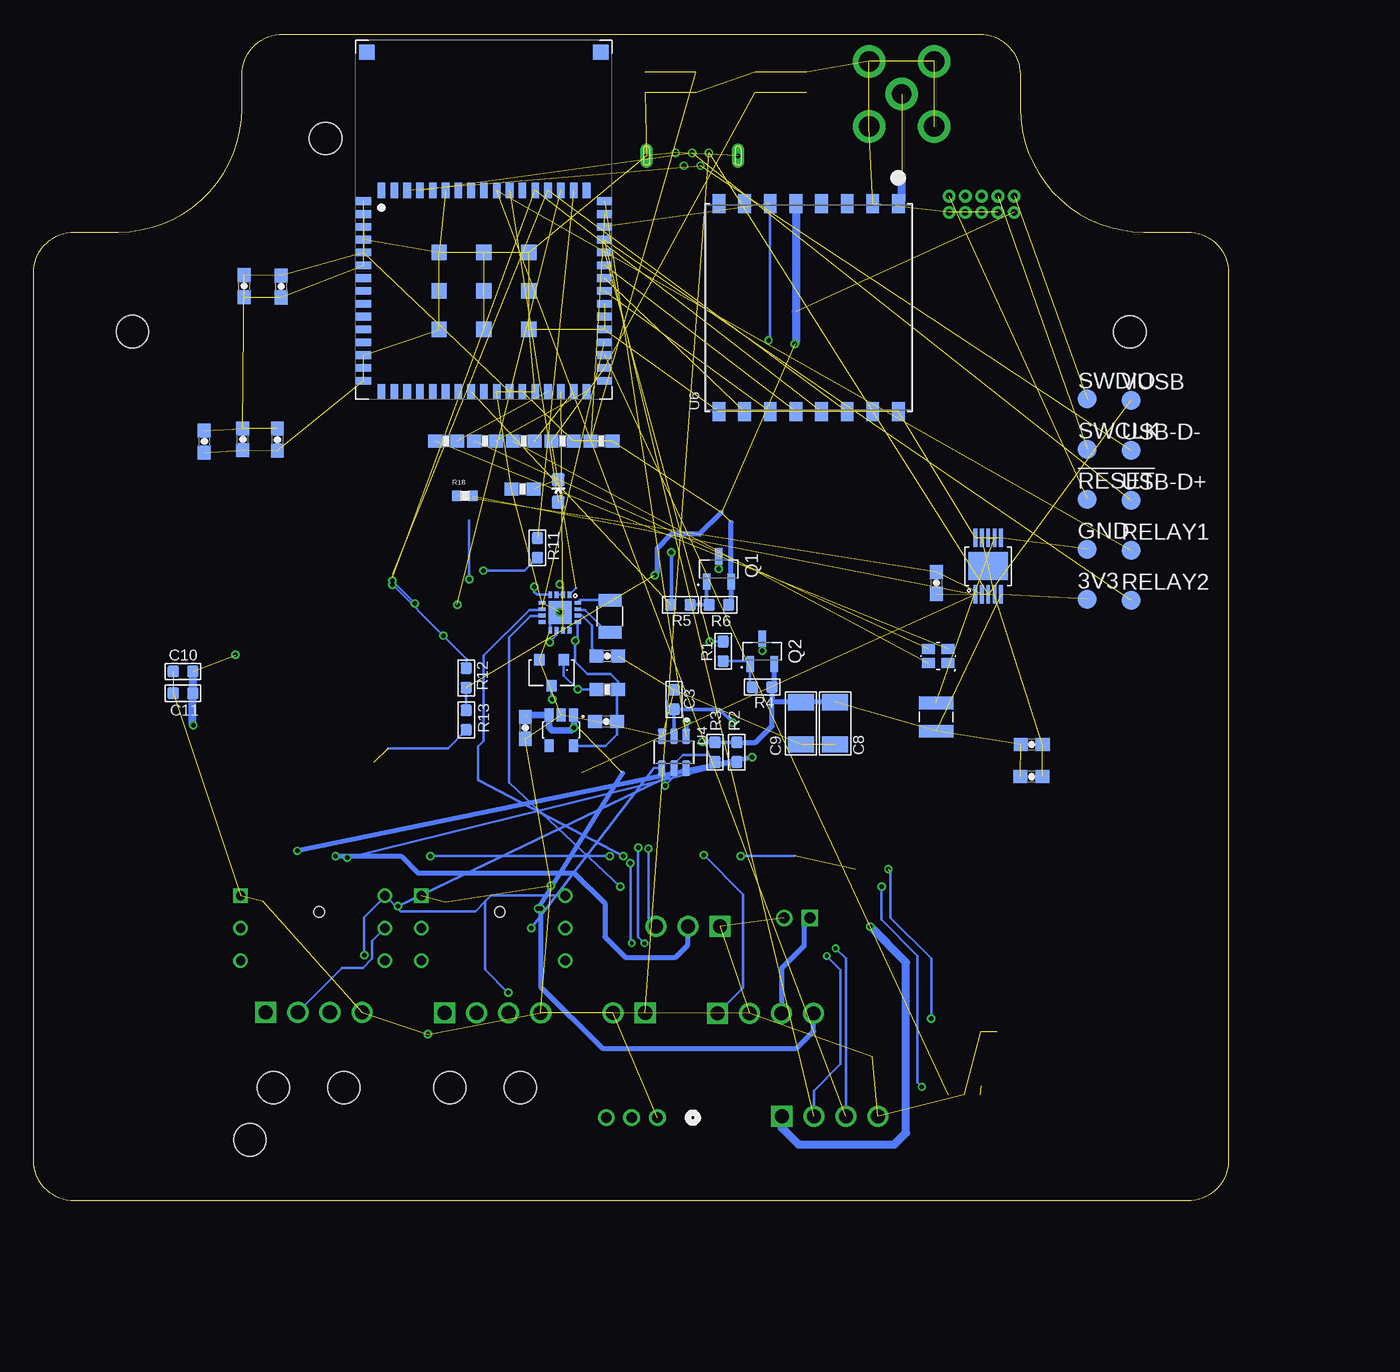
[diagram p4: board, bottom side, seen from below]

Size 93.19 x 91.02 mm. Coordinates in mm from the lower left corner, seen from the top.
Outline: 3.17,0 90.02,0 arc90 93.19,3.18 93.19,72.41 arc90 90.02,75.58 86.6,75.58 arc-90 76.95,85.24 76.95,87.84 arc90 73.77,91.02 19.42,91.02 arc90 16.24,87.84 16.24,85.24 arc-90 6.59,75.58 3.17,75.58 arc90 0,72.41 0,3.18 arc90 3.17,0
Copper layers (1*16): Top 0.035559375mm / dielectric 1.6mm / Bottom 0.035559375mm
Design rules "oshpark-2layer *": minimum track width 8mil, minimum drill 10mil, track to track 8mil, track to pad 8mil, pad to pad 8mil, via to via 8mil, smd to smd 0mil, copper to edge 10mil, drill to drill 6mil, minimum pad ring 5mil, minimum via ring 6mil, stop-mask expansion 2.5mil, vias tented up to drill 20mil, thermal gap 10mil
Holes 2.54 mm at 76.33,4.78 85.49,67.82 7.71,67.79 70.42,82.88
Holes 2.5 mm at 60.74,8.86 55.24,8.86 74.49,8.86 68.99,8.86

### Footprints (pad centres in the part's own frame; a part is rotated, then mirrored left to right if it is on the bottom)
TP15R = smd 1.5 x 1.5: TP 0,0
SHDR2W64P0X250_1X2_740X575X700 = drill 1.1 pad 1.65 square: 1 0,0 | drill 1.1 pad 1.65: 2 2.5,0
C0603 = smd 0.889 x 0.889: 1 0,0.762; 2 0,-0.762
0603-CAP = smd 1.1 x 1: 1 -0.85,0; 2 0.85,0
C1206 = smd 1.27 x 2.032: 1 -1.651,0; 2 1.651,0
LED-0603 = smd 1 x 1: A 0,-0.877; C 0,0.877
SHDR4W64P0X250_1X4_1240X575X70 = drill 1.1 pad 1.65 square: 1 0,0 | drill 1.1 pad 1.65: 2 2.5,0; 3 5,0; 4 7.5,0
JST_B2B-PH-K-S(LF)(SN) = drill 0.86 square: 1 1,-0.55 | drill 0.86: 2 -1,-0.55
614105150721 = drill 0.4: 1 -1.3,0.125; 2 -0.65,-0.875; 3 0,0.125; 4 0.65,-0.875; 5 1.3,0.125 | drill 0.35 pad 0.97 long: S1 -3.575,-0.095; S2 3.575,-0.095
2X5-PTH-1.27MM = drill 0.508 pad 1: 1 -2.54,-0.635; 2 -2.54,0.635; 3 -1.27,-0.635; 4 -1.27,0.635; 5 0,-0.635; 6 0,0.635; 7 1.27,-0.635; 8 1.27,0.635; 9 2.54,-0.635; 10 2.54,0.635
BOURNS-INDUCTOR-3X3 = smd 2.7 x 1: 1 0,1.1; 2 0,-1.1
LED-RGB-CREE-SMD = smd 1 x 0.8: 1 1.5,0; 2 0,0; 3 0,1.1; 4 1.5,1.1
SOT95P230X110-3N = smd 0.59 x 1.26: 1 -0.95,-0.98; 2 0.95,-0.98; 3 0,0.98
ABS07-120-CRYSTAL = smd 1 x 1.8: 1 -1.25,0; 2 1.25,0
2N7002L = smd 0.8 x 0.9: 1 0,0; 2 1.9,0; 3 0.95,2
R0603 = smd 0.889 x 0.889: 1 0,0.762; 2 0,-0.762
0603-RES = smd 1.1 x 1: 1 -0.85,0; 2 0.85,0
R0603_P = smd 0.7 x 0.85: 1 -0.65,0; 2 0.65,0
KMR2 = smd 1 x 1: 1 2,0.8; 2 2,-0.8; 3 -2,0.8; 4 -2,-0.8
SHDR3W64P0X250_1X3 = drill 1.1 pad 1.65 square: 1 0,0 | drill 1.1 pad 1.65: 2 2.5,0; 3 5,0
CONN_B3B-PH-K-S(LF)(SN)_JST = drill 0.813 pad 1.321: 1 0,0; 2 -2.007,0; 3 -3.988,0
XDCR_ABPDLNN100MG2A3 = drill 0.73 pad 1.13 square: 1 -2.54,5.625 | drill 0.73 pad 1.13: 2 0,5.625; 3 2.54,5.625; 4 2.54,-5.625; 5 0,-5.625; 6 -2.54,-5.625 | hole 0.8: -1.27,-0.5
SOT-25-TOREX = smd 0.7 x 1: 1 -0.95,-1.2; 2 0,-1.2; 3 0.95,-1.2; 4 0.95,1.2; 5 -0.95,1.2
SOT95P280X145-6N = smd 1.22 x 0.6: 1 -1.245,0.95; 2 -1.245,0; 3 -1.245,-0.95; 4 1.245,-0.95; 5 1.245,0; 6 1.245,0.95
16-VFQFN-ABRACON = smd 0.3 x 0.52: 1 -0.75,-1.39; 2 -0.25,-1.39; 3 0.25,-1.39; 4 0.75,-1.39; 9 0.75,1.39; 10 0.25,1.39; 11 -0.25,1.39; 12 -0.75,1.39 | smd 0.52 x 0.3: 5 1.39,-0.75; 6 1.39,-0.25; 7 1.39,0.25; 8 1.39,0.75; 13 -1.39,0.75; 14 -1.39,0.25; 15 -1.39,-0.25; 16 -1.39,-0.75 | smd 1.8 x 1.8: EP 0,0
RFMHCW_SMT = smd 1.5 x 1: 1P 8.1,-7; 2P 8.1,-5; 3P 8.1,-3; 4P 8.1,-1; 5P 8.1,1; 6P 8.1,3; 7P 8.1,5; 8P 8.1,7; 9P -8.1,7; 10P -8.1,5; 11P -8.1,3; 12P -8.1,1; 13P -8.1,-1; 14P -8.1,-3; 15P -8.1,-5; 16P -8.1,-7
10-HVSSOP-TI = smd 0.3 x 1.45: 1 -1,-2.2; 2 -0.5,-2.2; 3 0,-2.2; 4 0.5,-2.2; 5 1,-2.2; 6 1,2.2; 7 0.5,2.2; 8 0,2.2; 9 -0.5,2.2; 10 -1,2.2 | smd 3.1 x 2.2: P 0,0
8-SOIC-MAXIM = smd 0.53 x 1.98: 1 0,0; 2 1.27,0; 3 2.54,0; 4 3.81,0; 5 3.81,4.93; 6 2.54,4.93; 7 1.27,4.93; 8 0,4.93
P2 = smd 1.2 x 0.6: 1 0.6,15.45; 2 0.6,14.45; 3 0.6,13.45; 4 0.6,12.45; 5 0.6,11.45; 6 0.6,10.45; 7 0.6,9.45; 8 0.6,8.45; 9 0.6,7.45; 10 0.6,6.45; 11 0.6,5.45; 12 0.6,4.45; 13 0.6,3.45; 14 0.6,2.45; 15 0.6,1.45; 33 19.4,1.45; 34 19.4,2.45; 35 19.4,3.45; 36 19.4,4.45; 37 19.4,5.45; 38 19.4,6.45; 39 19.4,7.45; 40 19.4,8.45; 41 19.4,9.45; 42 19.4,10.45; 43 19.4,11.45; 44 19.4,12.45; 45 19.4,13.45; 46 19.4,14.45; 47 19.4,15.45 | smd 0.6 x 1.2: 16 2,0.6; 17 3,0.6; 18 4,0.6; 19 5,0.6; 20 6,0.6; 21 7,0.6; 22 8,0.6; 23 9,0.6; 24 10,0.6; 25 11,0.6; 26 12,0.6; 27 13,0.6; 28 14,0.6; 29 15,0.6; 30 16,0.6; 31 17,0.6; 32 18,0.6; 48 18,16.3; 49 17,16.3; 50 16,16.3; 51 15,16.3; 52 14,16.3; 53 13,16.3; 54 12,16.3; 55 11,16.3; 56 10,16.3; 57 9,16.3; 58 8,16.3; 59 7,16.3; 60 6,16.3; 61 5,16.3; 62 4,16.3; 63 3,16.3; 64 2,16.3 | smd 1.2 x 1.2: 65 6.5,11.45; 66 6.5,8.45; 67 6.5,5.45; 68 10,11.45; 69 10,8.45; 70 10,5.45; 71 13.5,11.45; 72 13.5,8.45; 73 13.5,5.45; 74 19.12,27.07; 75 0.88,27.07
SMA90_DIP = drill 1.5 pad 2.54: ANTENNA 0,0 | drill 1.6 pad 2.54: GND1 -2.54,2.54; GND2 2.54,2.54; GND3 -2.54,-2.54; GND4 2.54,-2.54

### Placement (x,y rotation side)
3V3  11.01,46.95 0 bottom
5V_IN  45.49,14.67 0 top
!RESET  11.01,54.75 0 bottom
C1  61.05,22.55 180 top
C2  75.34,22.65 180 top
C3  43.25,39.11 180 bottom
C4  27.79,11.99 0 top
C5  48.55,37.41 180 bottom
C6  54.85,36.91 270 bottom
C7  48.45,42.51 0 bottom
C8  30.68,37.26 270 bottom
C9  33.35,37.26 90 bottom
C10  81.55,41.31 270 bottom
C11  81.55,39.61 270 bottom
C13  15.37,33.11 0 bottom
C14  15.35,35.61 0 bottom
C15  79.88,59.24 270 bottom
C16  76.88,59.41 270 bottom
C17  74.18,59.39 270 bottom
C18  76.78,71.36 270 bottom
C19  73.88,71.34 270 bottom
C20  22.78,48.21 270 bottom
D1  52.28,55.39 0 bottom
GND  11.01,50.85 0 bottom
I2C1  61.14,14.69 180 top
I2C2  75.09,14.73 180 top
J1  33.66,21.53 180 top
J3  41.83,81.63 0 top
J4  19.25,77.75 0 top
L1  22.81,37.75 0 bottom
LED1  23.39,41.96 0 bottom
PB  39.87,14.63 180 top
Q1  39.75,49.31 0 bottom
Q2  36.37,42.88 0 bottom
Q3  48.25,45.61 90 bottom
Q4  51.85,42.21 180 bottom
R1  39.42,42.88 0 bottom
R2  38.35,35.01 180 bottom
R3  40.05,35.01 180 bottom
R4  36.37,40.09 270 bottom
R5  42.75,46.51 90 bottom
R6  39.75,46.51 270 bottom
R7  48.45,39.91 0 bottom
R8  52.64,6.01 0 top
R9  61.02,59.28 0 bottom
R10  57.99,59.28 0 bottom
R11  53.9,50.95 180 bottom
R12  59.45,40.81 180 bottom
R13  59.45,37.51 0 bottom
R14  54.97,59.28 0 bottom
R15  51.94,59.28 0 bottom
R16  48.92,59.28 0 bottom
R17  55.07,55.52 0 bottom
R18  59.55,55 0 bottom
RELAY  34.84,6.61 180 top
RELAY1  7.61,50.76 0 bottom
RELAY2  7.61,46.86 0 bottom
RESET  34.92,87.23 180 top
SETUP  43.52,87.26 180 top
SWCLK  11.01,58.65 0 bottom
SWDIO  11.01,62.55 0 bottom
TANK  39.66,21.43 0 top
TEMP  44.54,6.51 180 top
U1  57.34,21.28 270 top
U2  71.43,21.28 270 top
U3  52.05,36.71 180 bottom
U4  43.25,35.01 270 bottom
U5  52.15,45.91 180 bottom
U6  32.75,69.68 90 bottom
U7  18.74,49.52 0 bottom
U$2  18.08,8.27 0 top
U$3  68.07,62.53 0 bottom
USB-D+  7.61,54.67 0 bottom
USB-D-  7.61,58.57 0 bottom
VUSB  7.61,62.47 0 bottom
X1  25.49,86.35 0 top

### Tracks (layer width: path | path; a pad name or v marks a point on that pad's centre or on a via)
3.3V  (via drill 0.35)  (22 unrouted)
  Top 0.406: v77.45,42.61 68.85,42.61 61.55,49.91 47.65,49.91 46.55,48.81 v44.75,48.81 43.15,47.21 43.15,36.81 42.15,35.81 v41.05,35.81
  Top 0.61: v80.75,37.11 79.15,35.51 v27.94,21.41
  Bottom 0.203: R12.1 R13.1
  Bottom 0.254: R3.2 R2.2
  Bottom 0.305: C11.1 80.79,39.71
  Bottom 0.406: R6.1 38.8,46.7 Q1.2 38.8,52.95 | C8.1 C9.2 35.61,38.91 | Q2.2 35.42,40.27 R4.1 35.61,38.91 | v44.75,48.81 44.55,49.01 44.55,50.91 43.45,52.01 41.26,52.01 39.56,53.7 | R3.2 40.09,35.81 v41.05,35.81 | R2.2 36.89,35.77 35.61,37.05 35.61,38.91
  Bottom 0.61: RELAY.1 34.84,5.71 33.54,4.41 26.04,4.41 25.14,5.31 25.14,18.61 v27.94,21.41 | v80.75,37.11 80.79,37.15 80.79,39.71 C10.1 | v33.82,66.86 33.75,66.94 U6.5P 33.75,69.39
3V3R  (via drill 0.35)
  Top 0.203: v52.15,48.11 52.64,48.11 53.78,46.97 53.78,44.34 53.04,43.6 v52.95,43.6 51.06,43.6 v50.95,43.71
  Bottom 0.203: v52.15,48.11 51.9,47.86 U5.2 U5.3 | U5.13 50.76,43.9 v50.95,43.71 v50.95,43.7 50.95,42.08 49.98,41.1 48.2,41.1 47.6,40.51 R7.2 47.7,39.81 C5.1 47.7,36.41 48.6,35.51 U3.5 | U5.10 52.4,44.15 v52.95,43.6
!LORA_CS  (via drill 0.35)  (2 unrouted)
  Top 0.203: v65.22,48.07 65.22,48.62 | v61.25,44.11 62.65,44.11 65.14,41.62 65.14,33.57
  Bottom 0.203: v65.22,48.07 v61.25,44.11 59.42,42.28 59.42,41.57 R12.2
!RESET  (1 unrouted)
/IRQ2  (via drill 0.35)
  Top 0.203: v54.15,47.91 54.15,48.4 53.75,48.8 51.04,48.8 49.91,47.68 47.32,47.68 45.95,46.31 45.95,40.51 46.55,39.91 v50.75,39.91
  Bottom 0.203: U5.4 53.94,47.3 54.15,47.51 v54.15,47.91 | R7.1 v50.75,39.91 51.85,41.01 Q4.1
/RESET  (4 unrouted)
  Bottom 0.203: U5.1 50.89,47.81
AF
  Bottom 0.203: U5.14 50.42,45.66 49.65,44.89 49.65,43.13 49.3,42.78 C7.1
BAT
  Bottom 0.406: J1.1 33.11,21.62 33.11,19.9 34.87,18.15 PB.3
D7  (1 unrouted)
D10  (1 unrouted)
  Bottom 0.203: U5.11 51.95,44.47
EN  (via drill 0.35)  (2 unrouted)
  Top 0.203: v52.75,39.14 52.75,35.68 50.45,33.38
  Bottom 0.203: Q4.3 52.8,39.19 v52.75,39.14
GND  (via drill 0.35)  (81 unrouted)
  Bottom 0.203: 51.75,46.31 U5.EP 52.9,45.16 U5.9
  other vias: 62.44,13.01 52.15,45.91 52.84,24.61
LI+  (via drill 0.35)  (2 unrouted)
  Top 0.406: v53.86,22.81 v53.64,22.81 | C4.1 31.89,12.75 32.37,13.23 PB.4
  Top 0.508: v51.05,36.91 50.7,36.91
  Bottom 0.203: 54.77,37.83 C6.1 | 53,37.58 53,37.76
  Bottom 0.254: 53,37.76 U3.3
  Bottom 0.406: 47.26,33.38 v53.86,22.81 | v53.64,22.81 53.64,16.71 48.84,11.91 33.69,11.91 32.37,13.23 PB.4
  Bottom 0.508: v51.05,36.91 51.1,36.96 | v51.05,36.91 51.25,36.71 52.75,36.71 53,36.96 U3.3 54.7,37.91 | U3.1 51.05,37.86 v51.05,36.91
LORA_INT  (via drill 0.35)  (1 unrouted)
  Bottom 0.203: U6.6P 35.75,67.12 v35.88,67.12
LORA_RST  (via drill 0.35)  (3 unrouted)
  Top 0.203: 65.22,48.86 v65.22,48.37 | v63.45,46.61 66.67,43.39 66.67,34.2
  Bottom 0.203: v65.22,48.37 v63.45,46.61 | R13.2 60.89,35.31 65.56,35.31
LT  (1 unrouted)
MISO  (1 unrouted)
MOSI  (1 unrouted)
N$1
  Bottom 0.203: R1.2 37.54,42.12 Q2.1 37.32,40.27 R4.2
N$2
  Bottom 0.254: R5.2 R6.2 40.7,46.7 Q1.1
N$3  (via drill 0.35)
  Top 0.203: v40.93,26.99 66.16,34.65 65.54,35.27 65.54,43.42 59.78,49.17 v58.13,49.17
  Bottom 0.203: PB.1 37.87,16.63 37.87,23.93 v40.93,26.99 | v58.13,49.17 54.91,49.17 R11.1
N$4  (via drill 0.35)  (1 unrouted)
  Bottom 0.61: U6.1P 25.49,78.04 v25.49,79.92
N$5  (1 unrouted)
N$6  (1 unrouted)
N$7  (1 unrouted)
N$8  (1 unrouted)
RELAY1  (via drill 0.3, 0.35)  (2 unrouted)
  Top 0.203: 59.87,33.34 v46.04,27.56 | v45.54,20.11 45.24,19.81 30.74,19.81 v30.64,19.71
  Bottom 0.203: v46.04,27.56 46.04,20.61 v45.54,20.11 | v30.64,19.71 29.84,18.91 RELAY.3
RELAY2  (via drill 0.3, 0.35)  (2 unrouted)
  Top 0.203: v46.54,20.11 45.84,19.4 31.64,19.4 v31.34,19.11 | v59.23,48.5 58.55,47.83 58.55,32.86 v46.65,26.37
  Bottom 0.203: v46.54,20.11 46.65,20.22 v46.65,26.37 | v31.34,19.11 30.25,18.02 30.25,10.7 32.34,8.61 RELAY.2 | 59.23,53.06 v59.23,48.5 | v59.23,48.5
RGBB  (1 unrouted)
RGBG  (1 unrouted)
RGBR  (1 unrouted)
SCK  (1 unrouted)
SCL  (via drill 0.35)  (1 unrouted)
  Top 0.203: v68.74,26.76 U2.6 | U1.6 51.03,24.51 v47.44,24.51 35.25,24.51 | 21.89,8.81 U$2.4 23.27,8.27 v23.91,8.91 | 34.52,25.24 35.25,24.51 | v27.05,24.51 v27.06,24.51 35.25,24.51 | I2C1.3 56.14,16.21 v56.19,16.25 | I2C2.3 67.42,17.4 v67.42,19.17
  Bottom 0.203: R2.1 v68.74,26.76 | U2.6 65.76,23.78 | 65.76,23.78 64.59,22.61 58.74,22.61 57.99,23.36 | U1.6 57.53,23.82 57.99,23.36 | U5.7 53.59,45.61 54.45,45.61 56.11,43.96 56.11,32.66 v47.44,24.51 | v23.91,8.91 24.25,9.24 24.25,19.12 27.08,21.96 27.08,24.48 v27.05,24.51 | v56.19,16.25 57.99,18.06 57.99,23.36 | v67.42,19.17 67.42,22.04 67.41,22.05 67.41,22.13 65.76,23.78
SDA  (via drill 0.35)  (3 unrouted)
  Top 0.203: v62.24,26.91 v43.95,32.41 | v38.04,26.91 v47.21,26.91 v48.24,26.91 | 29.08,25.88 v26.53,25.88 | v23.18,14.22 22.15,13.2 U$2.5
  Bottom 0.203: R3.1 40.61,34.81 42.55,34.81 43.25,34.11 U4.5 43.25,33.11 v43.95,32.41 | 33.86,26.91 v38.04,26.91 | v48.24,26.91 v62.24,26.91 | U5.6 53.59,46.11 54.53,46.11 58.09,42.55 58.09,35.9 58.54,35.45 58.54,32.85 v47.21,26.91 | 26.35,25.71 26.35,22.1 23.18,18.93 v23.18,14.22
SDA1  (via drill 0.35)
  Top 0.203: v54.39,21.28 U1.5 55.18,17.82 55.51,17.82 I2C1.2
  Bottom 0.203: v54.39,21.28 44.82,33.76 U4.4
SDA2  (via drill 0.35)
  Top 0.203: U2.5 65.8,21.98 v64.79,22.99
  Bottom 0.203: U4.6 v64.79,22.99 | I2C2.2 69.14,18.18 67.51,18.18 66.78,18.91 66.78,20.3 U2.5
SETUP  (3 unrouted)
SW  (2 unrouted)
SWCLK  (1 unrouted)
SWDIO  (1 unrouted)
TEMP_DATA  (1 unrouted)
  Top 0.203: R8.1 52.64,8.61 51.74,9.51 | 46.5,6.51 TEMP.2 46.14,6.92 46.14,8.92 46.73,9.51 51.74,9.51 | 19.35,8.05 U$2.2 | 19.27,8.99 19.84,9.56 51.69,9.56 51.74,9.51
TON  (via drill 0.35)  (1 unrouted)
  Top 0.203: 49.71,51.81 42.65,51.81 41.25,50.41 41.25,44.41 v40.45,43.61
  Bottom 0.203: v40.45,43.61 40.42,43.64 R1.1
TPWR  (via drill 0.35)
  Top 0.406: v69.64,26.91 36.35,32.61 v36.35,42.91
  Bottom 0.406: Q2.3 36.37,42.93 v36.35,42.91 | TANK.2 42.16,19.99 43.14,19.01 47.04,19.01 48.64,20.61 48.64,23.21 51.04,25.61 63.24,25.61 64.54,26.91 v69.64,26.91
TSIG  (via drill 0.35)  (1 unrouted)
  Top 0.203: v45.24,27.47 61.15,32.78 61.15,34.08 60.52,34.7 60.52,46.1 60.15,46.46 v60.15,46.51
  Bottom 0.203: v45.24,27.47 45.24,22.09 44.66,21.51 TANK.3
USB-D+  (2 unrouted)
USB-D-  (2 unrouted)
VDD  (via drill 0.35)
  Top 0.203: 48.53,6.12 48.53,6.48 TEMP.3 | U$2.1 18.08,8.04
  Top 0.406: U2.2 75.95,21.28 C2.1 | C1.1 61.56,21.28 U1.2 64.04,20.21 70.34,20.21 | 70.34,20.21 73.66,20.21 C2.1 | v72.64,27.31 72.64,22.51 70.34,20.21 | v39.75,49.31 39.75,46.01 38.65,44.91 v38.65,37.31 38.65,36.11 v37.15,34.61 | C1.1 61.14,21.7 | TEMP.3 49.79,5.25 R8.2 54.28,5.25 61.14,12.11 I2C1.1 | U$2.1 18.08,7.71 19.28,6.51 25.7,6.51 27.08,5.13 47.17,5.13 48.52,6.48 48.53,6.48 | C1.1 61.05,14.78 I2C1.1 | I2C1.1 | C2.1 75.34,14.98 I2C2.1
  Bottom 0.254: U4.2 C3.1 39.69,38.35 v38.65,37.31
  Bottom 0.406: Q1.3 v39.75,49.31 | v37.15,34.61 v72.64,27.31
VPWR  (via drill 0.35)  (1 unrouted)
  Top 0.254: v43.45,50.61 43.45,50.81 44.02,51.38 52.47,51.38
  Bottom 0.254: v43.45,50.61 43.45,46.57 R5.1
VSEL  (via drill 0.35)  (1 unrouted)
  Top 0.254: v42.25,37.41 42.25,48.41 44.76,50.92 54.55,50.92
  Bottom 0.254: v42.25,37.41 42.25,36.61 42.3,36.56 U4.1
VUSB  (6 unrouted)
XI
  Bottom 0.203: Q3.2 50.56,46.86 U5.16
XO
  Bottom 0.203: U5.15 50.71,46.11 50.17,46.11 48.42,44.36 Q3.1
(copper drawn outside any net)
  shapes: Top area x2

### Text on the board
tPlace: Sensor / WiFi Hub / V1.0 | + | - | GND | PWR | SIG | VAC1 | VAC2 | ON | BAT | GND | LT | + | - | - | + | + | -